# Altium schematic sheet Rtc.SchDoc
size Letter; SheetNumber: 7; SheetTotal: 23
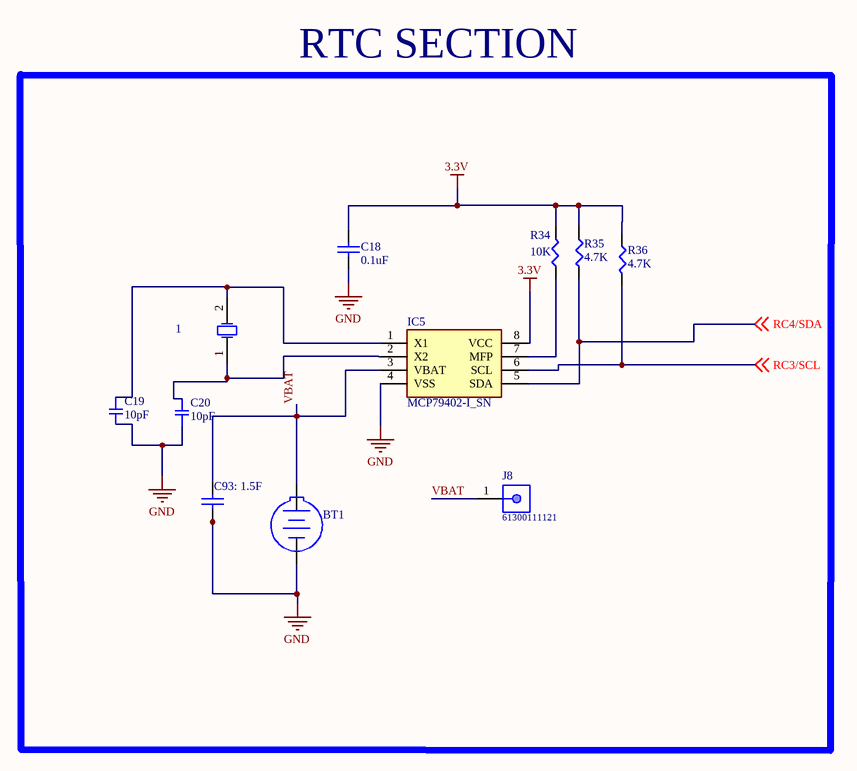
[diagram p0: Rtc.SchDoc]

## Parts
1  (no value)  [Mini Crystal]
BT1  79578211  [79578211]  (value not drawn)
C18  value 0.1uF  [C1206]  (hidden comment: Cap Semi)
C19  10pF  [SMD-0805C]
C20  10pF  [SMD-0805C]
IC5  MCP79402-I_SN  [SOIC127P600X175-8N]
J8  61300111121  [61300111121]
R34  10K  [SMD-0805-RES]
R35  4.7K  [SMD-0805-RES]
R36  4.7K  [SMD-0805-RES]
SuperCap1  C93: 1.5F  [C1206]  (hidden comment: Cap Semi)

## Blocks framed on the sheet
RTC SECTION: 1 BT1 C18-C20 IC5 J8 R34-R36 SuperCap1

## Nets
3.3V: C18.1 IC5.8(VCC) R34.2 R35.1 R36.1
GND: BT1.2(-) C18.2 C19.2 C20.2 IC5.4(VSS) SuperCap1.2
RC3/SCL: IC5.6(SCL) R36.2 ; off-sheet RC3/SCL
RC4/SDA: IC5.5(SDA) R35.2 ; off-sheet RC4/SDA
VBAT: BT1.1(+) IC5.3(VBAT) J8.1 SuperCap1.1
Net1_1: 1.1(X1) C20.1 IC5.2(X2)
Net1_2: 1.2(X2) C19.1 IC5.1(X1)
NetIC5_7: IC5.7(MFP) R34.1

## Library data of the parts
1 = Mini Crystal: 9B-64.000MBBK-B; Manufacturer: Abracon; PartNumber: ABLS2-4.096MHZ-D4Y-T; Operation Mode: Fundamental or 3rd Overtone; Shunt Capacitance: 7 pF Max.; Freq. Stability: +/- 30 ppm; Packing: Tape and Reel; ESR: 180 Ohm; Load Capacitance: 18 pF; Frequency: 4.096 MHz; Mounting Technology: Surface Mount; PackageDescription: 2-Pin SMD, Body 11.4 x 4.7 mm, Height 3.3 mm; ComponentLink1URL: http://www.abracon.com/; ComponentLink2Description: Datasheet; Operating Temp. Range: -40 to 85 degC; RoHS: TRUE; PackageReference: ABLS2-2; DatasheetVersion: Rev. 03.31.11; Freq. Tolerance: +/- 30 ppm; ComponentLink2URL: http://www.abracon.com/Resonators/ABLS2.pdf; ComponentLink1Description: Manufacturer URL
BT1 = 79578211: WA-BCPH Battery Holder, THT, battery type 2450; Manufacturer: Wurth Elektronik; Battery Type: 2450; ComponentLink1Description: Website Link; ComponentLink1URL: https://www.we-online.com/redexpert/article/79578211?ad; ComponentLink2Description: Datasheet Link; ComponentLink2URL: https://www.we-online.com/redexpert/spec/79578211?ad; Manufacturer Part Number: 79578211; Category: Battery Holders; Match Code: WA-BCPH; Mount: Through Hole; Operating Temperature Max: 105°C; Operating Temperature Min: -40°C; Packaging: Bag
C18 SuperCap1 = Cap Semi: Capacitor (Semiconductor SIM Model); Published: 8-Jun-2000; LatestRevisionDate: 29-May-2009; LatestRevisionNote: IPC-7351 Footprint Added.; PackageReference: C1206; Publisher: Altium Limited; PackageDescription: Chip Capacitor
C19 C20 = GCD21BR71H104KA01L: CAP CER 0.1UF 50V X7R 0805; Manufacturer: Murata Electronics North America; Factory Stock: 0; Unit Price (USD): 0.24; Minimum Quantity: 1; Value: 0.10µF; Tolerance: ±10%; Datasheets: http://www.murata.com/~/media/webrenewal/support/library/catalog/products/capacitor/mlcc/c03e.ashx; Image: //media.digikey.com/Renders/Murata%20Renders/0805%28GxM6%29.jpg; Digi-Key Part Number: 490-11955-1-ND; Part Number: GCD21BR71H104KA01L; Quantity Available: 157; @ qty: 0; Packaging: Cut Tape (CT); Series: GCD; Part Status: Active; Voltage: 50V; Temperature Coefficient: X7R; Operating Temperature: -55°C ~ 125°C; Features: -; Ratings: AEC-Q200; Applications: Automotive; Mounting Type: Surface Mount, MLCC; Package / Case: 0805 (2012 Metric); Size / Dimension: 0.079" L x 0.049" W (2.00mm x 1.25mm); Height - Seated (Max): -; Thickness (Max): 0.049" (1.25mm); Lead Spacing: -; Lead Style: -
IC5 = MCP79402-I_SN: Integrated Circuit; Manufacturer_Name: Microchip; Manufacturer_Part_Number: MCP79402-I/SN; Datasheet Link: https://componentsearchengine.com/Datasheets/2/MCP79402-I_SN.pdf; Height: 1.75mm; Mouser Part Number: 579-MCP79402ISN; Mouser Price/Stock: https://www.mouser.co.uk/ProductDetail/Microchip-Technology-Atmel/MCP79402-I-SN?qs=ggQiQSXuoRVK%2FFI6ElTaZQ%3D%3D; Arrow Part Number: MCP79402-I/SN; Arrow Price/Stock: https://www.arrow.com/en/products/mcp79402-isn/microchip-technology
J8 = 61300111121: WR-PHD Pin Header, THT, pitch 2.54mm, Single Row, Vertical, 1pin; Pin Number: 1; Gender: Male; Rated Current: 3A; Working Voltage: 250VAC; Withstanding Voltage: 500VAC; Contact Resistance: 20mOhm; ComponentLink1Description: Manufacturer; ComponentLink1URL: http://www.we-online.de; ComponentLink2Description: Datasheet; ComponentLink2URL: https://katalog.we-online.de/em/datasheet/6130xx11121.pdf; Part Number: 61300111121; Published Date: June 2019; Publisher: Wurth Elektronik; Pitch: 2.54mm; Operating Temperature: -40 to +105degC; Mounting Technology: THT; Packaging: Bag; Row Number: Single; Orientation: Vertical
R34-R36 = ERJ-6ENF1001V: RES SMD 1K OHM 1% 1/8W 0805; Manufacturer: Panasonic Electronic Components; Factory Stock: 0; Unit Price (USD): 0.00729; @ qty: 1500; Minimum Quantity: 1; Power (Watts): 0.125W, 1/8W; Temperature Coefficient: ±100ppm/°C; Part Number: ERJ-6ENF1001V; Datasheets: http://industrial.panasonic.com/www-cgi/jvcr13pz.cgi?E+PZ+3+AOA0002+ERJ6ENF1001V+7+WW; Image: //media.digikey.com/Renders/Panasonic%20Renders/ERJ-0805%20Pkg.jpg; Digi-Key Part Number: P1.00KCCT-ND; Quantity Available: 12895103; Packaging: Cut Tape (CT); Series: ERJ; Part Status: Active; Value: 1k; Tolerance: ±1%; Composition: Thick Film; Features: Automotive AEC-Q200; Operating Temperature: -55°C ~ 155°C; Package / Case: 0805 (2012 Metric); Supplier Device Package: 0805; Size / Dimension: 0.079" L x 0.049" W (2.00mm x 1.25mm); Height - Seated (Max): 0.028" (0.70mm); Number of Terminations: 2; Failure Rate: -